# Altium schematic sheet Miscellaneous Connectors.SchDoc: Miscellaneous Connectors
size 228 x 165 mm; DrawnBy: Joseph Riesen; DocumentNumber: 9; Revision: 1.0; SheetNumber: 9; SheetTotal: 10
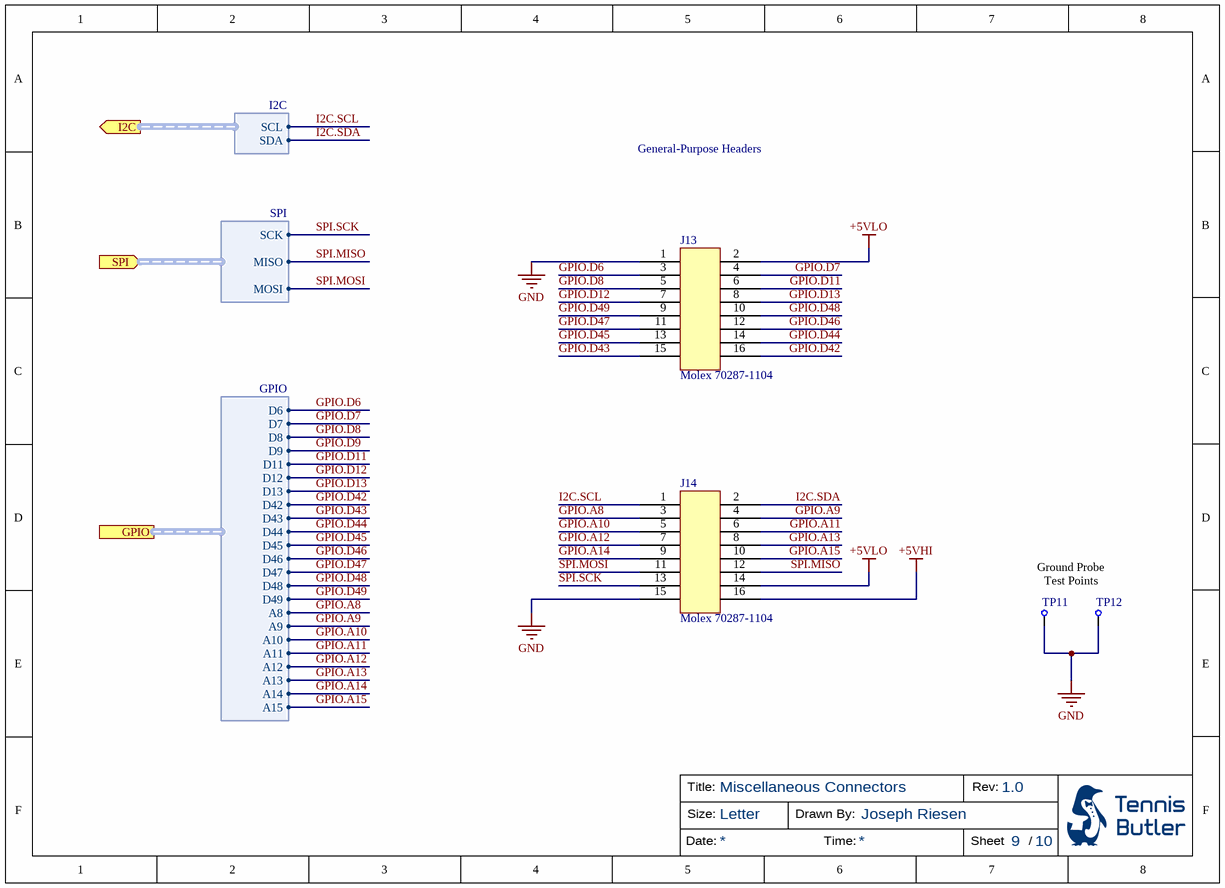
[diagram p0: Miscellaneous Connectors.SchDoc]

## Parts
J13  Molex 70287-1104  [Molex 70287-1104]
J14  Molex 70287-1104  [Molex 70287-1104]
TP11  GND  [Test Point]  (value not drawn)  (no BOM)
TP12  GND  [Test Point]  (value not drawn)  (no BOM)

## Ports
GPIO (harness GPIO), I2C (out, harness I2C), SPI (in, harness SPI)

## Harnesses
I2C: SCL, SDA
SPI: MISO, MOSI, SCK
GPIO: D6, D7, D8, D9, D42, D43, D44, D45, D46, D47, D48, D49, A8, A9, A10, A11, A12, A13, A14, A15, D13, D11, D12

## Nets
+5VHI: J14.16
+5VLO: J13.2 J14.14
GND: J13.1 J14.15 TP11.1 TP12.1
GPIO.A8: J14.3 ; port GPIO.A8
GPIO.A9: J14.4 ; port GPIO.A9
GPIO.A10: J14.5 ; port GPIO.A10
GPIO.A11: J14.6 ; port GPIO.A11
GPIO.A12: J14.7 ; port GPIO.A12
GPIO.A13: J14.8 ; port GPIO.A13
GPIO.A14: J14.9 ; port GPIO.A14
GPIO.A15: J14.10 ; port GPIO.A15
GPIO.D6: J13.3 ; port GPIO.D6
GPIO.D7: J13.4 ; port GPIO.D7
GPIO.D8: J13.5 ; port GPIO.D8
GPIO.D9: port GPIO.D9
GPIO.D11: J13.6 ; port GPIO.D11
GPIO.D12: J13.7 ; port GPIO.D12
GPIO.D13: J13.8 ; port GPIO.D13
GPIO.D42: J13.16 ; port GPIO.D42
GPIO.D43: J13.15 ; port GPIO.D43
GPIO.D44: J13.14 ; port GPIO.D44
GPIO.D45: J13.13 ; port GPIO.D45
GPIO.D46: J13.12 ; port GPIO.D46
GPIO.D47: J13.11 ; port GPIO.D47
GPIO.D48: J13.10 ; port GPIO.D48
GPIO.D49: J13.9 ; port GPIO.D49
I2C.SCL: J14.1 ; port I2C.SCL
I2C.SDA: J14.2 ; port I2C.SDA
SPI.MISO: J14.12 ; port SPI.MISO
SPI.MOSI: J14.11 ; port SPI.MOSI
SPI.SCK: J14.13 ; port SPI.SCK

## Notes on the sheet
- General-Purpose Headers
- Ground Probe Test Points
- Title:
- Size:
- Letter
- Drawn By:
- Rev:
- Date:
- Time:
- Sheet
- /

## Library data of the parts
J13 J14 = Molex 70287-1104 16-Pin (8x2) Male Header: CONN HEADER BKWY DL GOLD 16POS; Manufacturer Part Number: 0702871104; Number of Positions: 16; Max Voltage Rating (DC): 250V; Connector Type: Male Pin; Pitch: 2.54mm; Row Spacing: 0.1inch; Supplier 1: Digi-Key; Manufacturer: Molex; Stock 1: 0; Pricing 1: 2500 = 0.79674 (USD); RoHS 1: Yes; Mount: Through Hole; Contact Plating: Gold; Contact Material: Brass; Housing Material: Thermoplastic; Color: Black; Housing Color: Black; Min Operating Temperature: -40°C; Max Operating Temperature: 120°C; Number of Rows: 2; Packaging: Bulk; Termination: Solder; Orientation: Straight; Number of Contacts: 16; Length: 20.32mm; Contact Mating Length: 0.24inch; Depth: 5.08mm; ComponentLink1URL: https://datasheet.ciiva.com/10080/0702871104-pcb-headers-10080132.pdf?src-supplier=Avnet; ComponentLink1Description: Datasheet 1 (Avnet); ComponentLink2URL: https://datasheet.ciiva.com/2961/702871098-sd-2961617.pdf?src-supplier=Digi-Key; ComponentLink2Description: Datasheet 2 (Digi-Key); Supplier Part Number 1: 0702871104-ND
TP11 TP12 = Test Point